# EAGLE board LCD-OLINUXINO-7TS_Rev_D (EAGLE 4.16)
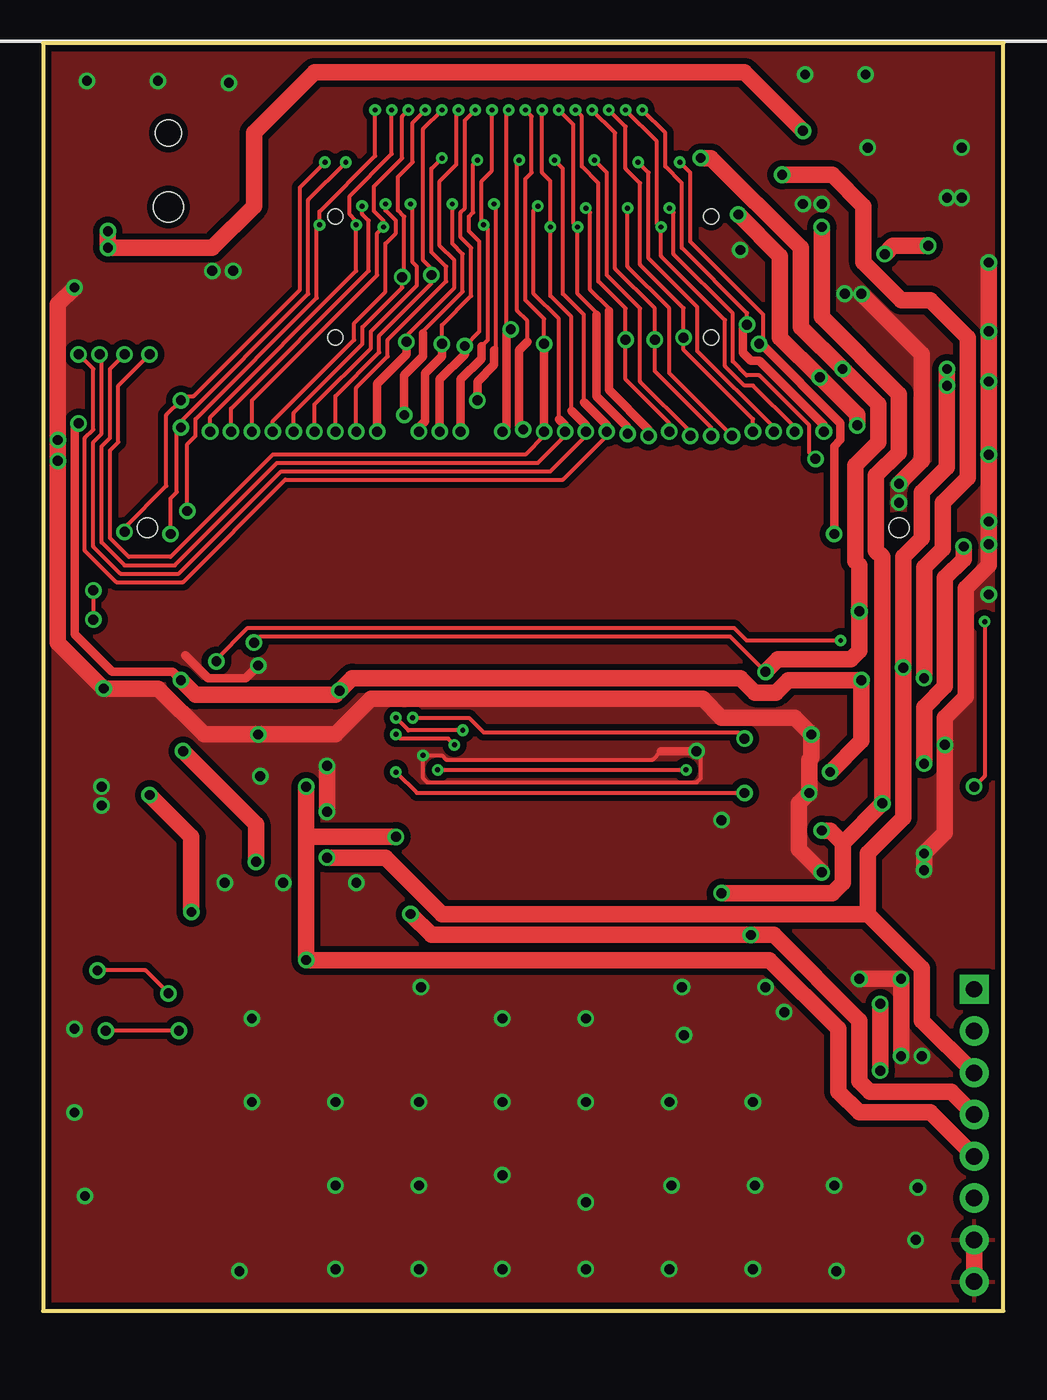
[diagram p1: board, top side]
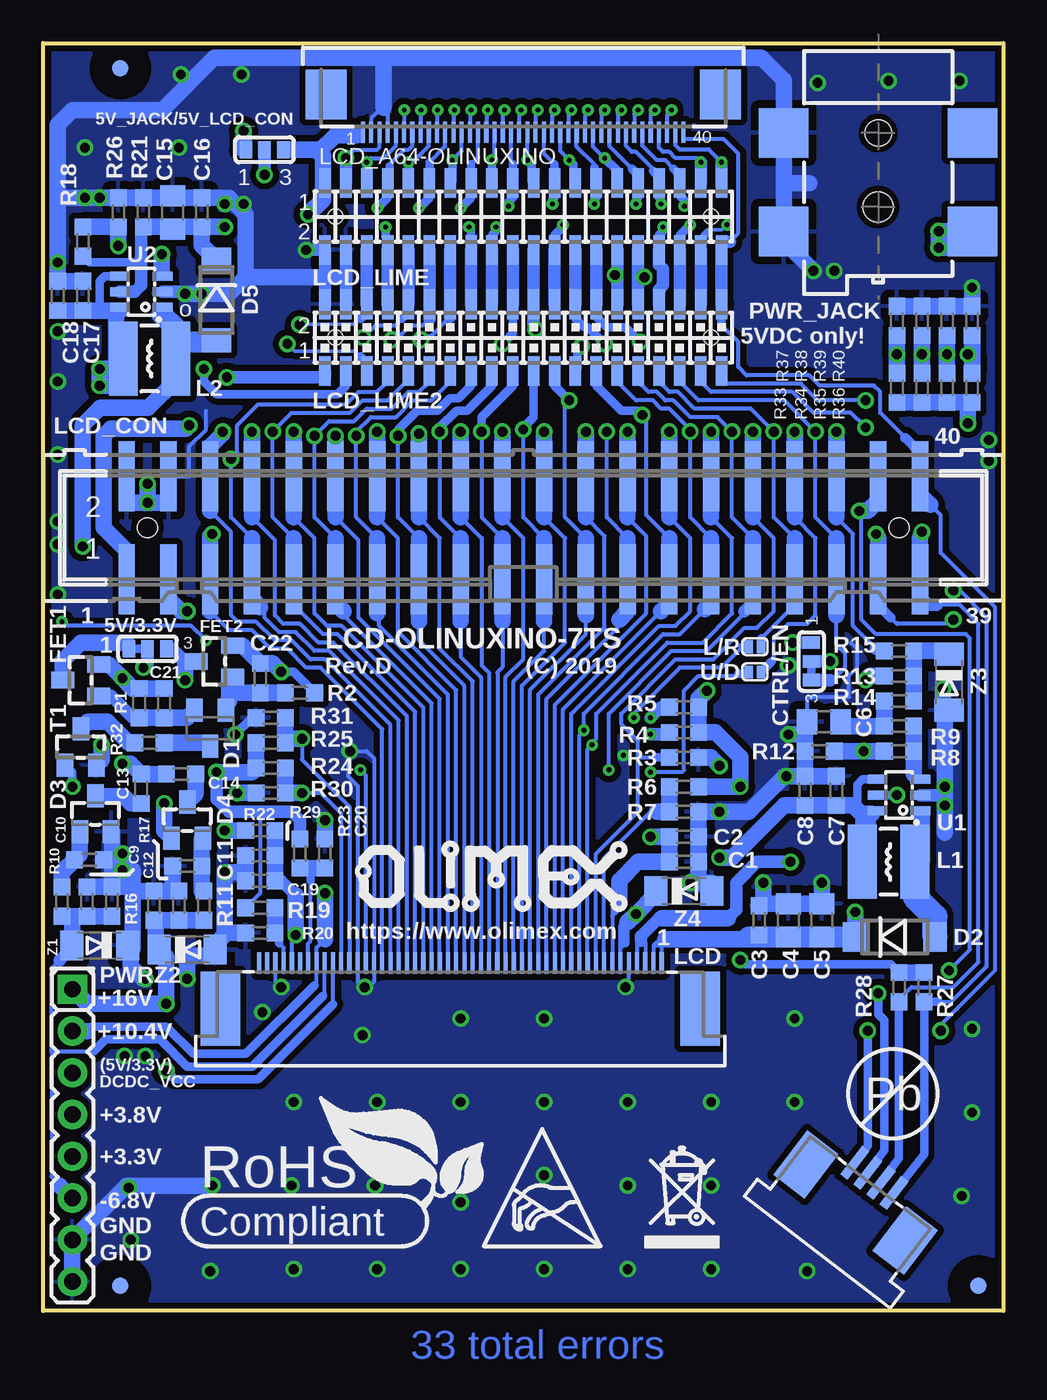
[diagram p2: board, bottom side, seen from below]

Size 58.42 x 77.09 mm. Coordinates in mm from the lower left corner, seen from the top.
Outline: 0,0 58.42,0 58.42,77.09 0,77.09 0,0
Copper layers (1+16): Top 0.035mm / dielectric 1.5mm / Bottom 0.035mm
Design rules "default": minimum track width 8mil, minimum drill 0.3mm, track to track 8mil, track to pad 8mil, pad to pad 8mil, via to via 8mil, smd to smd 1mil, copper to edge 10mil, drill to drill 8mil, minimum pad ring 8mil, minimum via ring 8mil, stop-mask expansion 4mil, vias tented up to drill 25mil, thermal gap 20mil
Net classes: 1 pwr: width 0.203 mm, drill 0.203 mm, clearance 0.203 mm

## Footprints (pad centres in the part's own frame; a part is rotated, then mirrored left to right if it is on the bottom)
SJ_2_SMALL_12_TIED = smd 0.762 x 1.016: 1 -1.143,0; 2 0,0; 3 1.143,0
SJ_2_SMALL = smd 0.762 x 1.016: 1 -1.143,0; 2 0,0; 3 1.143,0
C0603_DWS = smd 1.016 x 1.016: 1 -0.889,0; 2 0.889,0
C0805_5MIL_DWS = smd 1.27 x 1.524: 1 -1.016,0; 2 1.016,0
SJ_2_SMALL_23_TIED = smd 0.762 x 1.016: 1 -1.143,0; 2 0,0; 3 1.143,0
SOT23C = smd 1.4 x 1: 1 1.1,-0.95; 2 1.1,0.95; 3 -1.1,0
MLL-41 = smd 1.45 x 1.8: A 2.445,0; K -2.445,0
SOT23C(BAT54S) = smd 1.4 x 1: 1 1.1,-0.95; 2 1.1,0.95; 3 -1.1,0
SOT23 = smd 1.4 x 1: 1 1.1,-0.95; 2 1.1,0.95; 3 -1.1,0
CD42(43) = smd 1.75 x 4.5: 1 -1.6,0; 2 1.6,0
SJ_1_SMALLER = smd 0.508 x 0.762: 1 -0.381,0; 2 0.381,0
LCD7"_TOUCH(AT070TN90) = smd 0.25 x 1.3 bottom: 1 69.05,40.45; 2 69.55,40.45; 3 70.05,40.45; 4 70.55,40.45; 5 71.05,40.45; 6 71.55,40.45; 7 72.05,40.45; 8 72.55,40.45; 9 73.05,40.45; 10 73.55,40.45; 11 74.05,40.45; 12 74.55,40.45; 13 75.05,40.45; 14 75.55,40.45; 15 76.05,40.45; 16 76.55,40.45; 17 77.05,40.45; 18 77.55,40.45; 19 78.05,40.45; 20 78.55,40.45; 21 79.05,40.45; 22 79.55,40.45; 23 80.05,40.45; 24 80.55,40.45; 25 81.05,40.45; 26 81.55,40.45; 27 82.05,40.45; 28 82.55,40.45; 29 83.05,40.45; 30 83.55,40.45; 31 84.05,40.45; 32 84.55,40.45; 33 85.05,40.45; 34 85.55,40.45; 35 86.05,40.45; 36 86.55,40.45; 37 87.05,40.45; 38 87.55,40.45; 39 88.05,40.45; 40 88.55,40.45; 41 89.05,40.45; 42 89.55,40.45; 43 90.05,40.45; 44 90.55,40.45; 45 91.05,40.45; 46 91.55,40.45; 47 92.05,40.45; 48 92.55,40.45; 49 93.05,40.45; 50 93.55,40.45 | smd 0.55 x 2.2 rotated 217.5 bottom: 51 54.913,26.473; 52 55.707,27.082; 53 56.5,27.691; 54 57.294,28.299 | smd 2.4 x 4.5 bottom: P1 95.9,37.675; P2 66.7,37.675 | smd 2.4 x 3.4 rotated 217.5 bottom: P3 60.275,28.192; P4 54.245,23.566
FPV-WZA21-40-LF = smd 0.25 x 1.3: 1 -9.75,-2.75; 2 -9.25,-2.75; 3 -8.75,-2.75; 4 -8.25,-2.75; 5 -7.75,-2.75; 6 -7.25,-2.75; 7 -6.75,-2.75; 8 -6.25,-2.75; 9 -5.75,-2.75; 10 -5.25,-2.75; 11 -4.75,-2.75; 12 -4.25,-2.75; 13 -3.75,-2.75; 14 -3.25,-2.75; 15 -2.75,-2.75; 16 -2.25,-2.75; 17 -1.75,-2.75; 18 -1.25,-2.75; 19 -0.75,-2.75; 20 -0.25,-2.75; 21 0.25,-2.75; 22 0.75,-2.75; 23 1.25,-2.75; 24 1.75,-2.75; 25 2.25,-2.75; 26 2.75,-2.75; 27 3.25,-2.75; 28 3.75,-2.75; 29 4.25,-2.75; 30 4.75,-2.75; 31 5.25,-2.75; 32 5.75,-2.75; 33 6.25,-2.75; 34 6.75,-2.75; 35 7.25,-2.75; 36 7.75,-2.75; 37 8.25,-2.75; 38 8.75,-2.75; 39 9.25,-2.75; 40 9.75,-2.75 | smd 2.5 x 3: P1 12,-0.45; P2 -12,-0.45
ML40-MALE(GBH-254-SMT-40)_TEST = smd 1 x 4.25: 1 -24.13,-3.125; 2 -24.13,3.125; 3 -21.59,-3.125; 4 -21.59,3.125; 5 -19.05,-3.125; 6 -19.05,3.125; 7 -16.51,-3.125; 8 -16.51,3.125; 9 -13.97,-3.125; 10 -13.97,3.125; 11 -11.43,-3.125; 12 -11.43,3.125; 13 -8.89,-3.125; 14 -8.89,3.125; 15 -6.35,-3.125; 16 -6.35,3.125; 17 -3.81,-3.125; 18 -3.81,3.125; 19 -1.27,-3.125; 20 -1.27,3.125; 21 1.27,-3.125; 22 1.27,3.125; 23 3.81,-3.125; 24 3.81,3.125; 25 6.35,-3.125; 26 6.35,3.125; 27 8.89,-3.125; 28 8.89,3.125; 29 11.43,-3.125; 30 11.43,3.125; 31 13.97,-3.125; 32 13.97,3.125; 33 16.51,-3.125; 34 16.51,3.125; 35 19.05,-3.125; 36 19.05,3.125; 37 21.59,-3.125; 38 21.59,3.125; 39 24.13,-3.125; 40 24.13,3.125 | hole 1.2: -22.86,0; 22.86,0
YA-V36P-2X20-LF_0.9DRILL = smd 0.7 x 1.8: 1 -12.065,2.032; 2 -12.065,-2.032; 3 -10.795,2.032; 4 -10.795,-2.032; 5 -9.525,2.032; 6 -9.525,-2.032; 7 -8.255,2.032; 8 -8.255,-2.032; 9 -6.985,2.032; 10 -6.985,-2.032; 11 -5.715,2.032; 12 -5.715,-2.032; 13 -4.445,2.032; 14 -4.445,-2.032; 15 -3.175,2.032; 16 -3.175,-2.032; 17 -1.905,2.032; 18 -1.905,-2.032; 19 -0.635,2.032; 20 -0.635,-2.032; 21 0.635,2.032; 22 0.635,-2.032; 23 1.905,2.032; 24 1.905,-2.032; 25 3.175,2.032; 26 3.175,-2.032; 27 4.445,2.032; 28 4.445,-2.032; 29 5.715,2.032; 30 5.715,-2.032; 31 6.985,2.032; 32 6.985,-2.032; 33 8.255,2.032; 34 8.255,-2.032; 35 9.525,2.032; 36 9.525,-2.032; 37 10.795,2.032; 38 10.795,-2.032; 39 12.065,2.032; 40 12.065,-2.032 | hole 0.9: -11.43,0; 11.43,0
GPH127SMT-02X20(PA-V16X-2X20-LF)_DRILL_0.9MM = smd 0.7 x 1.8: 1 -12.065,-2.032; 2 -12.065,2.032; 3 -10.795,-2.032; 4 -10.795,2.032; 5 -9.525,-2.032; 6 -9.525,2.032; 7 -8.255,-2.032; 8 -8.255,2.032; 9 -6.985,-2.032; 10 -6.985,2.032; 11 -5.715,-2.032; 12 -5.715,2.032; 13 -4.445,-2.032; 14 -4.445,2.032; 15 -3.175,-2.032; 16 -3.175,2.032; 17 -1.905,-2.032; 18 -1.905,2.032; 19 -0.635,-2.032; 20 -0.635,2.032; 21 0.635,-2.032; 22 0.635,2.032; 23 1.905,-2.032; 24 1.905,2.032; 25 3.175,-2.032; 26 3.175,2.032; 27 4.445,-2.032; 28 4.445,2.032; 29 5.715,-2.032; 30 5.715,2.032; 31 6.985,-2.032; 32 6.985,2.032; 33 8.255,-2.032; 34 8.255,2.032; 35 9.525,-2.032; 36 9.525,2.032; 37 10.795,-2.032; 38 10.795,2.032; 39 12.065,-2.032; 40 12.065,2.032 | hole 0.9: -11.43,0; 11.43,0
HN1X8 = drill 1 pad 1.778 square: 1 -8.89,0 | drill 1 pad 1.778 round: 2 -6.35,0; 3 -3.81,0; 4 -1.27,0; 5 1.27,0; 6 3.81,0; 7 6.35,0; 8 8.89,0
PWR-JACK-SMD = smd 3 x 3: 1 6,5.75; 2 0,-5.75; 3 6,-5.75; 4 0,5.75 | hole 1.6: 0,0 | hole 1.8: 4.5,0
R0603_5MIL_DWS = smd 1.016 x 1.016: 1 -0.889,0; 2 0.889,0
SOT-23 = smd 1.4 x 1: 1 1.1,-0.95; 2 1.1,0.95; 3 -1.1,0
SOT23-6 = smd 1.2 x 0.55: 1 1.3,-0.95; 2 1.3,0; 3 1.3,0.95; 4 -1.3,0.95; 5 -1.3,0; 6 -1.3,-0.95
FIDUCIAL-1X3 = smd 1 x 1: 1 0,0
MINI-MELF = smd 1.4 x 1.8: 1 -1.7,0; 2 1.7,0

## Placement (x,y rotation side)
5V/3.3V  5V:Close/3.3V:Open  [SJ_2_SMALL_12_TIED]  52.07,40.26 0 bottom
5V_JACK/5V_LCD_CON  5V_JACK:Open/5V_LCD_CON:Soldered  [SJ_2_SMALL]  44.96,70.61 0 bottom
C1  22uF/6.3V  [C0603_DWS]  19.43,27.3 0 bottom
C2  100nF/Y5V/50VDC/20%  [C0603_DWS]  19.43,28.83 0 bottom
C3  100nF/Y5V/50VDC/20%  [C0603_DWS]  14.86,23.75 90 bottom
C4  1uF/25V/20%  [C0805_5MIL_DWS]  13.08,23.75 90 bottom
C5  1uF/25V/20%  [C0805_5MIL_DWS]  11.05,23.75 90 bottom
C6  10uF/16V  [C0805_5MIL_DWS]  10.92,35.81 180 bottom
C7  22uF/6.3V  [C0603_DWS]  10.16,31.62 270 bottom
C8  22uF/6.3V  [C0603_DWS]  12.06,31.62 270 bottom
C9  100nF/Y5V/50VDC/20%  [C0603_DWS]  55.75,24.89 90 bottom
C10  100nF/Y5V/50VDC/20%  [C0603_DWS]  55.63,27.43 0 bottom
C11  100nF/Y5V/50VDC/20%  [C0603_DWS]  49.66,27.05 180 bottom
C12  100nF/Y5V/50VDC/20%  [C0603_DWS]  51.69,24.64 90 bottom
C13  100nF/Y5V/50VDC/20%  [C0603_DWS]  52.45,31.75 90 bottom
C14  100nF/Y5V/50VDC/20%  [C0603_DWS]  50.04,32.64 0 bottom
C15  10uF/16V  [C0805_5MIL_DWS]  50.55,66.8 90 bottom
C16  100nF/Y5V/50VDC/20%  [C0603_DWS]  48.77,66.8 90 bottom
C17  22uF/6.3V  [C0603_DWS]  56.01,61.72 270 bottom
C18  22uF/6.3V  [C0603_DWS]  57.53,61.72 270 bottom
C19  100nF/Y5V/50VDC/20%  [C0603_DWS]  45.21,26.16 180 bottom
C20  100nF/Y5V/50VDC/20%  [C0603_DWS]  41.27,27.81 90 bottom
C21  22uF/6.3V  [C0603_DWS]  51.05,36.96 270 bottom
C22  100nF/Y5V/50VDC/20%  [C0603_DWS]  45.21,38.48 270 bottom
CTRL/EN  CTRL:Close/EN:Open  [SJ_2_SMALL_23_TIED]  11.68,39.5 270 bottom
D1  BAT54C  [SOT23C]  48.26,35.43 90 bottom
D2  1N5819/SS14  [MLL-41]  6.6,22.73 0 bottom
D3  BAT54S  [SOT23C(BAT54S)]  55.24,30.23 270 bottom
D4  BAT54S  [SOT23C(BAT54S)]  49.66,29.84 270 bottom
D5  1N5819/SS14  [MLL-41]  47.88,61.47 270 bottom
FET1  IRLML6402  [SOT23]  56.13,38.35 0 bottom
FET2  IRLML6402  [SOT23]  48.01,39.5 0 bottom
L1  4.7uH/1.15A/DCR<0.1R/CD43  [CD42(43)]  6.99,27.3 0 bottom
L2  4.7uH/1.15A/DCR<0.1R/CD43  [CD42(43)]  51.94,57.91 0 bottom
L/R  Open  [SJ_1_SMALLER]  15.11,40.39 0 bottom
LCD  AT070TN90+(FPV-WZA21-50-LF)+(FPA-WZB-25-04-LF)  [LCD7"_TOUCH(AT070TN90)]  -48.26,-19.29 0 top
LCD_A64-OLINUXINO  FPV-WZA21-40-LF  [FPV-WZA21-40-LF]  29.21,74.42 0 bottom
LCD_CON  GBH254SMT-40 (B-V-40-LF)  [ML40-MALE(GBH-254-SMT-40)_TEST]  29.21,47.62 0 bottom
LCD_LIME  GPH127SMT-02x20  [YA-V36P-2X20-LF_0.9DRILL]  29.21,66.55 0 bottom
LCD_LIME2  GPH127SMT-02x20  [GPH127SMT-02X20(PA-V16X-2X20-LF)_DRILL_0.9MM]  29.21,59.18 0 bottom
PWR  NA(HN1X8)  [HN1X8]  56.64,10.67 270 bottom
PWR_JACK  DCJ-W54R-20-LF  [PWR-JACK-SMD]  7.62,71.63 270 bottom
R1  20k/1%  [R0603_5MIL_DWS]  52.58,36.96 90 bottom
R2  20k/1%  [R0603_5MIL_DWS]  42.8,37.59 0 bottom
R3  NA  [R0603_5MIL_DWS]  19.43,33.66 180 bottom
R4  NA  [R0603_5MIL_DWS]  19.43,35.18 180 bottom
R5  NA  [R0603_5MIL_DWS]  19.43,36.7 180 bottom
R6  NA  [R0603_5MIL_DWS]  19.43,31.88 180 bottom
R7  10k  [R0603_5MIL_DWS]  19.43,30.35 180 bottom
R8  2.2k  [R0603_5MIL_DWS]  6.35,34.04 180 bottom
R9  20k/1%  [R0603_5MIL_DWS]  6.35,35.56 180 bottom
R10  1k/1%  [R0603_5MIL_DWS]  57.28,24.89 90 bottom
R11  1k/1%  [R0603_5MIL_DWS]  48.64,24.64 90 bottom
R12  2.2R  [R0603_5MIL_DWS]  11.18,34.04 180 bottom
R13  4.7k  [R0603_5MIL_DWS]  6.35,38.61 180 bottom
R14  4.7k  [R0603_5MIL_DWS]  6.35,37.08 180 bottom
R15  220R  [R0603_5MIL_DWS]  6.35,40.13 0 bottom
R16  51k/1%  [R0603_5MIL_DWS]  54.23,24.89 270 bottom
R17  51k/1%  [R0603_5MIL_DWS]  50.16,24.64 270 bottom
R18  51k/1%  [R0603_5MIL_DWS]  56.01,65.02 270 bottom
R19  10k  [R0603_5MIL_DWS]  45.21,24.51 0 bottom
R20  NA  [R0603_5MIL_DWS]  45.21,22.99 0 bottom
R21  20k/1%  [R0603_5MIL_DWS]  52.32,66.8 270 bottom
R22  1k/1%  [R0603_5MIL_DWS]  45.21,29.21 0 bottom
R23  10k  [R0603_5MIL_DWS]  42.8,27.81 270 bottom
R24  NA  [R0603_5MIL_DWS]  44.58,33.02 0 bottom
R25  10k  [R0603_5MIL_DWS]  44.58,34.54 0 bottom
R26  1k/1%  [R0603_5MIL_DWS]  53.85,66.8 90 bottom
R27  NA  [R0603_5MIL_DWS]  4.83,19.68 270 bottom
R28  NA  [R0603_5MIL_DWS]  6.35,19.68 270 bottom
R29  560R/1%  [R0603_5MIL_DWS]  45.21,27.69 180 bottom
R30  10k  [R0603_5MIL_DWS]  44.58,31.5 180 bottom
R31  NA  [R0603_5MIL_DWS]  44.58,36.07 180 bottom
R32  1k/1%  [R0603_5MIL_DWS]  51.94,34.54 0 bottom
R33  NA  [R0603_5MIL_DWS]  6.48,56.13 270 bottom
R34  NA  [R0603_5MIL_DWS]  4.95,56.13 270 bottom
R35  51k/1%  [R0603_5MIL_DWS]  3.43,56.13 270 bottom
R36  51k/1%  [R0603_5MIL_DWS]  1.91,56.13 270 bottom
R37  51k/1%  [R0603_5MIL_DWS]  6.48,60.2 270 bottom
R38  51k/1%  [R0603_5MIL_DWS]  4.95,60.2 270 bottom
R39  NA  [R0603_5MIL_DWS]  3.43,60.2 270 bottom
R40  NA  [R0603_5MIL_DWS]  1.91,60.2 270 bottom
T1  DTC114YKA  [SOT-23]  56.13,34.29 270 bottom
U1  AP3031KTR-G1  [SOT23-6]  6.35,31.37 0 bottom
U2  AP3031KTR-G1  [SOT23-6]  52.45,61.98 0 bottom
U$1  FIDUCIAL  [FIDUCIAL-1X3]  1.52,1.52 270 bottom
U$2  FIDUCIAL  [FIDUCIAL-1X3]  53.72,1.52 270 bottom
U$3  FIDUCIAL  [FIDUCIAL-1X3]  53.72,75.56 270 bottom
U$8  [OLIMEX1_V]  21.72,24.14 0 bottom
U$9  [PB]  6.73,13.21 0 bottom
U$10  [ESD_SYMBOL]  31.62,3.94 0 bottom
U$11  [RECYCLE_BIN1/8]  21.84,3.81 0 bottom
U$12  [ROHS]  48.9,4.57 0 bottom
U/D  Open  [SJ_1_SMALLER]  15.11,38.86 0 bottom
Z1  BZV55C6V8  [MINI-MELF]  54.99,22.23 180 bottom
Z2  BZV55C16  [MINI-MELF]  49.66,21.97 0 bottom
Z3  NA(BZV55C3V6)  [MINI-MELF]  3.3,38.23 270 bottom
Z4  NA(BZV55C4V3)  [MINI-MELF]  19.43,25.53 0 bottom

## Tracks (layer width: path | path; a pad name or v marks a point on that pad's centre or on a via)
+5V  (via drill 0.6)
  Top 1.016: 50.16,24.13 24.26,24.13 20.83,27.56 v17.27,27.56 | 50.16,24.13 50.16,27.81 52.32,29.97 v52.32,39.12 52.32,45.85 53.47,46.99 53.47,49.78 54.99,51.31 v54.99,56.26 v54.99,57.28 | 50.16,24.13 53.47,20.83 53.47,17.65 PWR.3
  Bottom 0.508: 53.72,60.83 53.72,61.03 U2.6 | U2.4 54.68,62.93 54.99,62.61 54.99,60.83 | U1.4 8.57,32.32 8.89,32 8.89,30.99 9.14,30.73 | U1.6 7.75,30.42 7.75,30.23 8,30.23
  Bottom 0.762: 5V/3.3V.2 52.07,39.37 v52.32,39.12
  Bottom 1.016: C18.2 C17.2 54.99,60.83 53.98,60.83 | 53.98,60.83 53.72,60.83 | v17.27,27.56 16.51,27.56 13.34,30.73 C8.2 C7.2 9.14,30.73 8.64,30.23 8.38,30.23 | 8.38,30.23 8,30.23 | L1.1 8.38,27.3 | 8.38,29.72 8.38,30.23 | L2.1 53.54,57.28 53.85,57.28 | 53.98,57.28 53.85,57.28 | 53.98,57.28 v54.99,57.28 v54.99,56.26 53.85,56.26 53.85,57.28 | 53.98,57.28 53.98,60.83
  Bottom 1.27: 8.38,27.3 8.38,29.72
+12V  (via drill 0.6)
  Top 1.016: v47.37,65.91 47.37,60.45 52.07,55.75 52.07,52.2 50.67,50.8 50.67,46.23 51.05,45.85 v51.05,30.86 48.64,28.45 | v41.27,25.4 48.01,25.4 48.64,26.04 48.64,28.45 | v47.37,29.21 47.88,29.21 48.64,28.45
  Bottom 0.254: 41.92,19.8 41.79,19.93 LCD.43 41.79,22.09 41.27,22.61
  Bottom 0.508: 52.47,63.75 55.63,63.75 R18.2 | 41.92,19.8 46.1,15.62 49.28,15.62 50.93,17.27 55.5,17.27 55.75,17.02
  Bottom 0.762: U2.5 52.85,61.98 52.47,62.36 52.47,63.75 52.47,65.91 R21.2
  Bottom 1.016: 50.55,65.91 R21.2 | 50.55,65.91 C15.1 | C16.1 50.55,65.91 | C16.1 48.77,64.8 D5.K | D4.1 51.05,29.19 v51.05,30.86 | v47.37,29.21 R22.1 | 55.75,17.02 PWR.2 | 41.27,22.61 v41.27,25.4 | v47.37,65.91 C16.1
+15V  (via drill 0.6)
  Top 1.016: v50.93,14.61 v50.93,18.67
  Bottom 0.254: 40.79,18.65 LCD.41
  Bottom 0.508: v50.93,14.61 50.42,14.1 45.34,14.1 40.79,18.65
  Bottom 1.016: R11.1 R17.2 51.56,23.75 | PWR.1 55.75,18.67 v50.93,18.67 50.93,21.54 Z2.1 51.56,22.18 51.56,23.75 | 51.56,23.75 C12.1
-24V
  Bottom 0.254: 57.4,21.34 57.91,20.83 57.91,15.75 | 57.4,7.62 57.91,8.13 57.91,15.75 | 55.37,15.75 57.91,15.75 | 41.4,19.18 41.29,19.29 LCD.42
  Bottom 0.508: 55.37,15.75 54.61,16.51 51.31,16.51 49.66,14.86 45.72,14.86 41.4,19.18
  Bottom 0.762: Z1.2 56.69,22.05 57.4,21.34
  Bottom 1.016: 57.4,7.62 PWR.6 | 56.64,24 C9.1 R16.2 | 56.64,24 R10.1 | Z1.2 56.64,22.27 56.64,24
GND  (via drill 0.3, 0.6, 0.6 pad 1.02)
  Top 0.254: 37.59,34.04 37.08,33.53 24.51,33.53 24.26,33.78 v23.11,33.78 23.11,32.38 23.37,32.13 39.75,32.13 40.01,32.38 40.01,33.78 v39.75,34.04
  Top 0.508: v39.75,34.04 37.59,34.04 | 8.64,39.88 10.03,38.48 12.32,38.48 v13.08,39.24
  Top 1.016: v47.37,26.67 45.97,28.07 45.97,30.86 v46.61,31.5 46.61,33.53 46.74,33.66 v46.74,35.05 45.72,36.07 41.27,36.07 40.13,37.21 19.94,37.21 17.78,35.05 v13.08,35.05 9.78,35.05 6.99,37.85 v3.68,37.85 0.89,40.64 v0.89,51.69 v0.89,52.96 0.89,61.21 v1.91,62.23 | v17.27,30.35 v17.27,33.15 | v49.66,20.19 v52.2,20.19 v52.2,15.49 | PWR.7 PWR.8 | v57.53,63.75 v57.53,48.01 v57.53,46.61 57.53,45.34 56.13,43.94 56.13,37.34 54.86,36.07 v54.86,34.42 54.86,29.08 v53.59,27.81 v53.59,26.8 | v52.07,50.29 53.47,51.69 53.47,58.17 v49.78,61.85
  Bottom 0.254: LCD_A64-OLINUXINO.2 38.46,72.54 37.85,73.15 37.72,73.15 37.46,72.89 LCD_A64-OLINUXINO.4 | LCD.5 22.79,19.88 v22.99,19.68 | v43.94,19.68 44.29,20.03 LCD.48 | C6.2 11.94,37.34 9.4,37.34 9.4,38.61 8.89,39.12 8.89,40.26 9.27,40.64 | LCD_CON.4 49.53,50.75 49.53,52.58 48.51,53.59 48.51,54.74 | 39.88,32.51 39.29,31.92 LCD.38 39.29,19.99 38.99,19.68 v38.86,19.68 38.61,19.68 38.29,20 LCD.36 38.29,33.59 38.73,34.04 v39.75,34.04 39.88,33.91 39.88,32.51
  Bottom 0.508: 45.59,31.5 R30.2 | R31.2 45.72,36.07 v46.74,35.05
  Bottom 0.762: v49.78,61.85 49.91,61.98 U2.2 | 41.27,62.87 LCD_LIME2.2 | 41.27,62.87 LCD_LIME.2 v42.42,64.52 | 40.01,62.87 LCD_LIME2.4 | 40.01,62.87 LCD_LIME.4 | 41.27,62.87 40.01,62.87 | 3.56,31.37 U1.2
  Bottom 1.016: v49.78,61.85 v48.77,61.85 47.12,61.85 46.1,62.87 | C17.1 C18.1 v57.53,63.75 57.53,67.69 | 50.55,67.69 R21.1 R26.2 v54.99,67.69 57.53,67.69 | 50.55,67.69 C15.2 | 50.55,67.69 C16.2 47.12,67.69 46.1,66.67 46.1,62.87 | 50.55,25.53 C11.2 | 46.1,26.67 R29.2 | 46.1,26.67 v47.37,26.67 47.37,23.11 47.24,22.99 | 46.1,26.67 C19.2 | v46.61,31.5 45.59,31.5 | 14.61,24.77 C4.2 C5.2 v11.05,26.04 | 14.61,24.77 14.86,24.77 C3.2 14.73,24.77 14.61,24.77 | C8.1 C7.1 | C8.1 R12.2 12.06,35.05 | C6.2 12.06,35.69 12.06,35.05 | v13.08,35.05 12.06,35.05 | v17.27,33.15 17.78,33.66 R3.1 | 46.1,62.87 41.27,62.87 | LCD_CON.4 50.8,49.15 v52.07,49.15 | v52.07,49.15 53.34,49.15 LCD_CON.2 | v3.68,37.85 3.68,36.53 Z3.2 3.56,36.53 v3.56,31.88 3.56,31.37 v3.56,30.73 3.56,29.08 | T1.2 54.86,33.51 v54.86,34.42 | PWR.8 PWR.7 53.34,7.62 v48.13,7.62 | 57.53,67.69 57.53,72.14 56.64,73.03 51.18,73.03 48.01,76.2 37.72,76.2 | 37.72,76.2 37.72,73.15 | 37.72,76.2 14.73,76.2 13.37,74.84 PWR_JACK.2 13.37,68.58 | C8.1 v13.21,32.51 13.34,32.51 15.49,30.35 v17.27,30.35 R7.1 C2.2 C1.2 18.54,26.04 | 14.61,24.77 v14.61,26.04 | 47.24,22.99 R20.1 | D3.2 54.23,29.13 54.23,27.43 | 54.23,27.43 C10.2 | 53.59,27.43 v53.59,27.81 | 54.23,27.43 53.59,27.43 | R16.1 54.23,27.43 | R16.1 C9.2 | C20.2 v41.27,29.84 | 53.59,27.43 v53.59,26.8 52.96,26.8 52.96,25.53 | 50.55,25.53 R17.1 | 50.55,25.53 C12.2 52.96,25.53 | v52.2,20.19 52.32,20.19 53.09,20.95 53.09,22.02 | 53.09,22.02 Z1.1 | v49.66,20.19 49.66,21.21 49.28,21.59 47.96,21.59 Z2.2 47.96,22.27 47.24,22.99 | 53.09,22.02 52.96,22.02 52.96,25.53 | 52.96,25.53 53.21,25.78 R16.1 | 18.54,26.04 v19.05,26.04 | Z4.2 17.73,26.04 18.54,26.04
  Bottom 1.016: 13.37,68.58 PWR_JACK.3 13.37,65.06 v11.56,63.25 | 13.37,68.58 11.81,68.58 | v1.91,62.23 R40.1 R39.1 R38.1 R37.1 | v52.07,50.29 v52.07,49.15
  other vias: 17.78,2.54 17.78,7.62 17.78,12.7 12.7,12.7 12.7,17.78 22.86,12.7 22.86,7.62 22.86,2.54 27.94,2.54 33.02,2.54 38.1,2.54 43.18,2.54 43.31,7.62 43.18,12.7 53.47,15.49 38.1,12.7 33.02,12.7 27.94,12.7 27.94,8.26 27.94,17.78 33.02,17.78 38.99,16.76 2.54,6.99 1.91,12.06 1.91,17.14 57.53,43.56 55.88,70.74 55.88,67.69 57.53,52.07 57.53,56.52 45.09,18.16 48.26,2.41 53.21,7.49 53.09,4.32 38.23,7.62 33.02,6.6 11.94,2.41 11.3,74.68 6.99,74.8 2.67,74.8 46.35,75.18 50.04,75.18 50.16,70.74 10.29,63.25 57.53,59.56 47.37,67.31 46.23,67.31
  pour Top (isolate 0.381, rank 2): -5.08,77.98 -5.08,-2.54 63.5,-2.54 63.5,77.98
  pour Bottom (isolate 0.381, rank 3): -7.62,-5.08 66.04,-5.08 66.04,80.52 -7.62,80.52
LCD_B0  (via drill 0.3, 0.6)
  Top 0.254: v28.96,69.98 28.83,69.85 28.83,60.83 29.46,60.2 29.46,58.93
  Top 0.508: 29.46,58.93 28.96,58.42 28.96,53.85 v29.21,53.59
  Bottom 0.254: LCD.19 29.79,38.28 27.94,40.13 27.94,41.92 | 27.94,46.99 29.21,48.26 v29.21,53.59 | LCD_A64-OLINUXINO.21 v28.96,69.98
  Bottom 0.508: v28.96,69.98 28.7,69.72 28.7,68.71 LCD_LIME.21 | LCD_LIME2.21 28.57,54.36 29.21,53.72 v29.21,53.59
  Bottom 1.016: 27.94,41.92 LCD_CON.21 27.94,46.99
LCD_B1  (via drill 0.3, 0.6)
  Top 0.254: v28.45,59.69 28.19,59.94 28.19,72.9 v28.32,73.03
  Top 0.508: v28.45,59.69 28.19,59.44 28.19,53.72 v27.94,53.47
  Bottom 0.254: LCD.18 29.29,38.02 26.67,40.64 26.67,46.99 27.94,48.26 | LCD_A64-OLINUXINO.22 28.46,72.89 v28.32,73.03
  Bottom 0.762: LCD_LIME.22 LCD_LIME2.22 28.57,59.82 v28.45,59.69
  Bottom 1.016: 27.94,48.26 LCD_CON.22 v27.94,53.47
LCD_B2  (via drill 0.3, 0.6)
  Top 0.254: v27.43,67.31 27.56,67.18 27.56,58.55 27.43,58.42
  Top 0.508: 27.43,58.42 27.43,57.53 26.42,56.52 v26.42,55.37
  Bottom 0.254: LCD.17 28.79,37.76 25.4,41.15 25.4,42.31 | 25.4,46.99 26.67,48.26 26.67,55.63 | LCD_A64-OLINUXINO.23 27.96,70.38 27.3,69.72
  Bottom 0.508: v27.43,67.31 27.43,67.56 27.3,67.69 LCD_LIME.23 27.3,69.72 | LCD_LIME2.23 27.3,56.26 26.67,55.63 v26.42,55.37
  Bottom 1.016: 25.4,42.31 LCD_CON.23 25.4,46.99
LCD_B3  (via drill 0.3, 0.6)
  Top 0.254: 26.67,58.67 27.05,59.05 27.05,65.79 v26.8,66.04 26.67,66.17 26.67,68.71 27.3,69.34 v27.3,73.03
  Top 0.508: 26.67,58.67 26.67,57.91 25.4,56.64 v25.4,53.47
  Bottom 0.254: LCD.16 28.29,37.5 24.26,41.53 24.26,47.12 25.4,48.26 | LCD_A64-OLINUXINO.24 27.46,72.87 v27.3,73.03
  Bottom 0.508: v26.8,66.04 26.8,65.91 27.3,65.41 LCD_LIME.24
  Bottom 0.762: LCD_LIME.24 LCD_LIME2.24
  Bottom 1.016: 25.4,48.26 LCD_CON.24 v25.4,53.47
LCD_B4  (via drill 0.3, 0.6)
  Top 0.254: v26.42,69.98 26.16,69.72 26.16,66.8 25.91,66.55 25.91,65.66 26.54,65.02 26.54,59.56 v25.65,58.67
  Top 0.508: v25.65,58.67 25.65,58.17 24.13,56.64 v24.13,53.47
  Bottom 0.254: LCD.15 27.79,37.23 23.37,41.66 23.37,42.04 | 22.86,46.99 24.13,48.26 v24.13,53.47 | LCD_A64-OLINUXINO.25 26.96,70.52 v26.42,69.98
  Bottom 0.508: v26.42,69.98 26.16,69.72 26.16,68.71 LCD_LIME.25 | LCD_LIME2.25 25.91,57.28 25.91,58.42 v25.65,58.67
  Bottom 1.016: 23.37,42.04 22.86,42.55 LCD_CON.25 22.86,46.99
LCD_B5  (via drill 0.3, 0.6)
  Top 0.254: v24.26,58.8 24.26,59.94 26.04,61.72 26.04,64.64 25.4,65.28 25.4,66.8 25.65,67.06 25.65,72.39 v26.29,73.03
  Top 0.508: v24.26,58.8 24.26,58.04 23.24,57.02 23.24,54.1 22.86,53.72 v22.86,53.47
  Bottom 0.254: LCD.14 27.29,36.84 21.72,42.42 21.72,47.12 22.86,48.26 | LCD_A64-OLINUXINO.26 26.46,72.85 v26.29,73.03
  Bottom 0.508: LCD_LIME2.26 26.04,60.33 25.53,59.82 25.27,59.82 v24.26,58.8
  Bottom 0.762: LCD_LIME2.26 LCD_LIME.26
  Bottom 1.016: 22.86,48.26 LCD_CON.26 v22.86,53.47
LCD_B6  (via drill 0.3, 0.6)
  Top 0.254: v24.89,67.31 24.89,64.9 25.53,64.26 25.53,61.98 23.11,59.56 23.11,59.44
  Top 0.508: 23.11,59.44 23.11,58.04 21.97,56.9 v21.97,54.48
  Bottom 0.254: LCD.13 26.79,36.58 20.83,42.55 | 20.32,46.99 21.72,48.39 21.72,54.23 v21.97,54.48 | LCD_A64-OLINUXINO.27 25.96,70.79 24.89,69.72 24.89,69.55
  Bottom 0.508: v24.89,67.31 24.89,67.56 24.77,67.69 LCD_LIME.27 24.89,68.71 24.89,69.55 | LCD_LIME2.27 24.77,56.26 23.24,54.74 22.23,54.74 v21.97,54.48
  Bottom 1.016: 20.83,42.55 20.32,43.05 LCD_CON.27 20.32,46.99
LCD_B7  (via drill 0.3, 0.6)
  Top 0.254: v22.1,58.93 22.1,59.31 25.02,62.23 25.02,63.88 24.13,64.77 24.13,68.71 25.15,69.72 25.15,72.9 v25.27,73.03
  Top 0.508: v22.1,58.93 22.1,58.17 20.32,56.39 v20.32,53.47
  Bottom 0.254: LCD.12 26.29,36.32 20.95,41.66 19.94,41.66 19.05,42.55 19.05,46.99 20.32,48.26 | LCD_A64-OLINUXINO.28 25.46,72.84 v25.27,73.03
  Bottom 0.508: LCD_LIME2.28 24.77,60.45 24.13,59.82 22.99,59.82 v22.1,58.93
  Bottom 0.762: LCD_LIME2.28 LCD_LIME.28
  Bottom 1.016: 20.32,48.26 LCD_CON.28 v20.32,53.47
LCD_BKL  (via drill 0.3, 0.6)
  Top 0.254: v10.16,53.47 10.16,54.36 19.05,63.25 v19.05,66.04 19.05,66.27 18.64,66.67 18.64,67.79 21.21,70.36 v21.21,73.03
  Bottom 0.254: 7.75,40.26 9.14,41.66 9.14,47.24 10.16,48.26 | LCD_A64-OLINUXINO.36 21.46,72.77 v21.21,73.03
  Bottom 0.508: LCD_LIME.36 19.68,65.41 v19.05,66.04
  Bottom 0.762: R15.1 7.24,40.26 7.75,40.26 | LCD_LIME.36 LCD_LIME2.36
  Bottom 1.016: 10.16,48.26 LCD_CON.36 v10.16,53.47
LCD_CLK  (via drill 0.3, 0.6)
  Top 0.254: v16.51,53.47 16.51,55.12 19.94,58.55 19.94,59.56 22.73,62.36 22.73,63.5 22.48,63.75 22.48,67.18 v22.35,67.31 | v24,32.89 v39.12,32.89
  Bottom 0.254: 15.24,46.99 16.51,48.26 v16.51,53.47 17.4,54.36 19.05,54.36 20.07,55.37 20.57,55.37 21.08,55.88 21.59,55.88 22.23,56.52 LCD_LIME2.31 | LCD_A64-OLINUXINO.31 23.96,70.82 22.61,69.47 | LCD.37 38.79,32.57 v39.12,32.89 | 15.75,42.55 15.75,42.42 18.03,40.13 20.19,40.13 24,36.32 v24,32.89
  Bottom 0.508: v22.35,67.31 22.35,67.56 22.23,67.69 LCD_LIME.31 22.23,69.09 22.61,69.47
  Bottom 0.762: 15.75,42.55 15.24,43.05 LCD_CON.31
  Bottom 1.016: LCD_CON.31 15.24,46.99
LCD_DE  (via drill 0.3, 0.6)
  Top 0.254: v15.24,53.47 15.24,54.61 19.43,58.8 19.43,59.82 21.84,62.23 v21.84,62.87 21.97,62.99 21.97,66.55 21.59,66.93 21.59,68.96 22.48,69.85 22.48,72.26 v23.24,73.03
  Bottom 0.254: LCD.9 24.79,27.79 22.23,30.35 22.23,33.66 | 22.23,33.66 22.23,34.67 23.24,35.69 23.24,36.32 19.94,39.62 17.65,39.62 15.75,41.53 14.99,41.53 13.97,42.55 13.97,46.99 15.24,48.26 | 22.23,33.66 21.08,33.66 | LCD_A64-OLINUXINO.32 23.46,72.81 v23.24,73.03
  Bottom 0.508: 21.08,33.66 R3.2
  Bottom 0.762: 22.23,62.87 LCD_LIME2.32 | 22.23,62.87 LCD_LIME.32 | v21.84,62.87 22.23,62.87
  Bottom 1.016: 15.24,48.26 LCD_CON.32 v15.24,53.47
LCD_G0  (via drill 0.3, 0.6)
  Top 0.254: v33.53,69.98 34.29,69.22 34.29,62.99 36.32,60.96 36.32,56.52 39.37,53.47 v39.37,53.21
  Bottom 0.254: LCD.27 33.79,37.47 37.97,41.66 37.97,42.31 38.1,42.43 | LCD_LIME2.13 33.66,56.52 34.8,55.37 35.94,55.37 36.96,54.36 38.48,54.36 39.37,53.47 v39.37,53.21 39.37,48.26 38.1,46.99 | LCD_A64-OLINUXINO.13 32.96,70.55 v33.53,69.98
  Bottom 0.508: v33.53,69.98 33.53,68.71 LCD_LIME.13
  Bottom 1.016: 38.1,42.43 LCD_CON.13 38.1,46.99
LCD_G1  (via drill 0.3, 0.6)
  Top 0.254: v38.1,53.47 38.1,53.98 35.43,56.64 v35.43,59.05 35.43,60.96 33.78,62.61 33.78,68.58 32.77,69.6 32.77,72.64 v32.38,73.03
  Bottom 0.254: LCD.26 33.29,37.75 36.83,41.29 36.83,46.99 38.1,48.26 | 33.66,60.45 34.8,59.31 35.18,59.31 v35.43,59.05 | LCD_A64-OLINUXINO.14 32.46,72.95 v32.38,73.03
  Bottom 0.762: LCD_LIME.14 LCD_LIME2.14 33.66,60.45
  Bottom 1.016: 38.1,48.26 LCD_CON.14 v38.1,53.47
LCD_G2  (via drill 0.3, 0.6)
  Top 0.254: v33.02,67.06 33.27,66.8 33.27,62.1 34.42,60.96 34.42,60.83
  Top 0.508: 34.42,60.83 34.42,56.01 36.83,53.59 v36.83,53.21
  Bottom 0.254: LCD.25 32.79,38.01 35.56,40.78 35.56,41.92 | 35.56,46.99 36.83,48.26 v36.83,53.21 | LCD_A64-OLINUXINO.15 31.96,70.15 32.38,69.72
  Bottom 0.508: v33.02,67.06 32.38,67.69 LCD_LIME.15 32.38,69.72 | v36.83,53.21 36.83,53.59 35.69,54.74 34.42,54.74 33.66,55.5 33.15,55.5 32.38,56.26 LCD_LIME2.15
  Bottom 1.016: 35.56,41.92 LCD_CON.15 35.56,46.99
LCD_G3  (via drill 0.3, 0.6)
  Top 0.254: 33.66,60.58 33.66,60.71 32.51,61.85 v32.51,65.91 32.26,66.17 32.26,72.14 v31.37,73.03
  Top 0.508: 33.66,60.58 33.66,55.63 35.56,53.72 v35.56,53.34
  Bottom 0.254: LCD.24 32.29,38.27 34.29,40.27 34.29,46.99 35.56,48.26 | LCD_A64-OLINUXINO.16 31.46,72.93 v31.37,73.03
  Bottom 0.508: LCD_LIME.16 32.38,65.79 v32.51,65.91
  Bottom 0.762: LCD_LIME.16 LCD_LIME2.16
  Bottom 1.016: 35.56,48.26 LCD_CON.16 v35.56,53.34
LCD_G4  (via drill 0.3, 0.6)
  Top 0.254: v31.11,69.98 31.62,69.47 31.62,61.85 32.89,60.58 32.89,55.24 | v34.29,53.47 34.29,53.21 31.62,50.55 14.73,50.55 8.51,44.32 4.45,44.32 2.54,46.23 2.54,53.09 3.05,53.59 3.05,57.28 v2.16,58.17
  Top 0.508: 32.89,55.24 34.29,53.85 v34.29,53.47
  Bottom 0.254: LCD.23 31.79,38.54 33.02,39.77 33.02,41.92 | 33.02,46.99 34.29,48.26 v34.29,53.47 | LCD_A64-OLINUXINO.17 30.96,70.26 31.11,70.1 v31.11,69.98
  Bottom 0.508: v31.11,69.98 LCD_LIME.17 | LCD_LIME2.17 31.11,56.26 32.64,54.74 33.27,54.74 34.29,53.72 v34.29,53.47
  Bottom 1.016: 33.02,41.92 LCD_CON.17 33.02,46.99 | 1.91,58.17 R36.1 | v2.16,58.17 1.91,58.17 | 1.91,58.17 R40.2
LCD_G5  (via drill 0.3, 0.6)
  Top 0.254: 32.13,54.74 32.13,60.45 30.86,61.72 v30.86,65.91 30.86,68.71 30.35,69.22 v30.35,73.03 | v33.02,53.47 33.02,53.21 30.86,51.05 14.48,51.05 8.26,44.83 4.7,44.83 3.05,46.48 3.05,52.83 3.56,53.34 3.56,58.04 v3.43,58.17
  Top 0.508: v33.02,53.47 33.02,53.85 32.13,54.74
  Bottom 0.254: LCD.22 31.29,38.8 31.75,39.26 31.75,46.99 33.02,48.26 | LCD_A64-OLINUXINO.18 30.46,72.92 v30.35,73.03
  Bottom 0.508: v30.86,65.91 30.86,65.66 31.11,65.41 LCD_LIME.18
  Bottom 0.762: LCD_LIME.18 LCD_LIME2.18
  Bottom 1.016: 33.02,48.26 LCD_CON.18 v33.02,53.47 | R35.1 v3.43,58.17 R39.2
LCD_G6  (via drill 0.3, 0.6)
  Top 0.254: v30.1,67.18 29.84,66.93 29.84,61.85 31.37,60.33 31.37,54.23 | v31.75,53.47 31.75,53.21 30.1,51.56 14.22,51.56 8,45.34 4.95,45.34 3.56,46.74 3.56,52.58 4.06,53.09 4.06,57.28 v4.95,58.17
  Top 0.508: v31.75,53.47 31.75,53.85 31.37,54.23
  Bottom 0.254: LCD.21 30.79,38.82 30.48,39.13 30.48,41.92 | 30.48,46.99 31.75,48.26 v31.75,53.47 | LCD_A64-OLINUXINO.19 29.96,69.84 29.84,69.72
  Bottom 0.508: v30.1,67.18 30.1,67.44 29.84,67.69 LCD_LIME.19 29.84,69.72 | v31.75,53.47 31.75,54.36 29.84,56.26 LCD_LIME2.19
  Bottom 1.016: 30.48,41.92 LCD_CON.19 30.48,46.99 | R34.1 v4.95,58.17 R38.2
LCD_G7  (via drill 0.3, 0.6)
  Top 0.254: v30.48,58.8 30.48,60.33 29.34,61.47 29.34,68.83 29.72,69.22 29.72,72.64 v29.34,73.03 | v30.48,53.47 30.48,53.21 29.34,52.07 13.97,52.07 7.75,45.85 5.21,45.85 4.06,46.99 4.06,52.32 4.57,52.83 4.57,56.26 v6.48,58.17
  Top 0.508: v30.48,53.47 v30.48,58.8
  Bottom 0.254: LCD.20 30.29,38.56 29.21,39.64 29.21,46.99 30.48,48.26 | LCD_A64-OLINUXINO.20 29.46,72.9 v29.34,73.03
  Bottom 0.508: LCD_LIME2.20 29.84,59.44 v30.48,58.8
  Bottom 0.762: LCD_LIME2.20 LCD_LIME.20
  Bottom 1.016: 30.48,48.26 LCD_CON.20 v30.48,53.47 | R33.1 v6.48,58.17 R37.2
LCD_HSYNC  (via drill 0.3, 0.6)
  Top 0.254: v25.53,35.31 22.23,35.31 v21.46,36.07 | v24.26,70.1 23.62,69.47 23.62,64.39 24.51,63.5 24.51,62.61 20.95,59.05 20.95,58.04 19.05,56.13 v19.05,53.47
  Bottom 0.254: LCD.11 25.79,35.04 v25.53,35.31 25.53,36.32 20.7,41.15 19.68,41.15 18.16,42.67 | 17.78,46.99 19.05,48.26 v19.05,53.47 19.05,53.59 20.32,54.86 20.83,54.86 21.34,55.37 22.35,55.37 23.5,56.52 LCD_LIME2.29 | LCD_A64-OLINUXINO.29 24.96,70.81 v24.26,70.1
  Bottom 0.508: v24.26,70.1 23.5,69.34 LCD_LIME.29
  Bottom 0.762: v21.46,36.07 20.83,36.7 R5.2
  Bottom 1.016: 18.16,42.67 17.78,43.05 LCD_CON.29 17.78,46.99
LCD_L/R  (via drill 0.3, 0.6)
  Top 0.254: v42.67,34.8 42.29,35.18 26.8,35.18 25.91,36.07 v22.48,36.07
  Bottom 0.254: LCD.39 39.79,30.65 42.67,33.53 v42.67,34.8 | 15.88,40.39 17.14,39.12 19.68,39.12 22.48,36.32 v22.48,36.07
  Bottom 0.508: L/R.1 15.88,40.39
  Bottom 1.016: 43.69,34.8 R31.1 | 43.69,34.8 R25.2 | v42.67,34.8 43.69,34.8
LCD_PWRE  (via drill 0.3, 0.6)
  Top 0.254: v11.43,53.47 11.43,54.86 19.81,63.25 19.81,66.29 19.41,66.7 v19.41,67.18
  Bottom 0.254: 10.16,46.99 11.43,48.26 v11.43,53.47 13.34,55.37 18.54,55.37 19.68,56.52 LCD_LIME2.35 | 10.54,38.35 10.41,38.35 9.65,39.12 9.65,40.01 10.16,40.51 10.16,42.29 | LCD_A64-OLINUXINO.35 21.96,70.86 21.08,69.98 20.57,69.98 20.07,69.47
  Bottom 0.508: v19.41,67.18 19.41,67.54 19.68,67.82 LCD_LIME.35 19.68,69.09 20.07,69.47
  Bottom 0.762: 10.54,38.35 CTRL/EN.3
  Bottom 1.016: 10.16,46.99 LCD_CON.35 10.16,42.29
LCD_R0  (via drill 0.3, 0.6)
  Top 0.254: v38.73,69.85 39.37,69.22 39.37,65.02 43.81,60.58 43.81,59.05 v43.56,58.8
  Top 0.508: v43.56,58.8 43.69,58.8 48.51,53.98 48.51,52.96 48.13,52.58 v48.13,47.24
  Bottom 0.203: 39.12,58.04 39.45,58.37 43.13,58.37 v43.56,58.8
  Bottom 0.254: LCD.35 37.79,35.38 41.53,39.12 42.42,39.12 43.56,40.26 44.58,40.26 45.72,41.4 47.12,41.4 48.26,42.55 | LCD_LIME.5 38.73,67.94 | LCD_A64-OLINUXINO.5 36.96,70.86 37.72,70.1 38.48,70.1 v38.73,69.85
  Bottom 0.508: v38.73,69.85 LCD_LIME.5 | LCD_LIME2.5 38.73,57.66 39.12,58.04
  Bottom 1.016: 48.26,42.55 LCD_CON.5 48.26,47.12 v48.13,47.24
LCD_R1  (via drill 0.3, 0.6)
  Top 0.254: v42.82,59.97 42.82,60.68 38.86,64.64 38.86,68.58 37.85,69.6 37.85,71.63 v36.45,73.03
  Top 0.508: v42.82,59.97 42.57,59.72 42.57,58.27 43.05,57.78 43.56,57.78 47.5,53.85 v47.5,53.47
  Bottom 0.203: v42.82,59.97 42.8,59.99 39.45,59.99 39.12,60.33
  Bottom 0.254: 48.26,48.64 46.99,47.37 46.99,42.31 46.59,41.91 45.47,41.91 44.32,40.77 43.29,40.77 42.15,39.62 41.27,39.62 37.29,35.64 LCD.34 | LCD_A64-OLINUXINO.6 36.46,73.01 v36.45,73.03
  Bottom 0.508: LCD_LIME2.6 38.73,60.71 39.12,60.33
  Bottom 0.762: LCD_LIME2.6 LCD_LIME.6
  Bottom 1.016: 48.26,48.64 LCD_CON.6 48.26,52.58 47.5,53.34 v47.5,53.47
LCD_R2  (via drill 0.3, 0.6)
  Top 0.254: v38.1,67.06 38.35,66.8 38.35,64.26 41.96,60.66 41.96,57.73 42.8,56.9 43.56,56.9 46.61,53.85 46.61,52.2 v46.99,51.82
  Bottom 0.254: LCD.33 36.79,35.9 41.02,40.13 41.91,40.13 43.05,41.27 44.07,41.27 44.96,42.16 44.96,42.55 45.21,42.8 | LCD_LIME2.7 37.47,56.52 38.1,55.88 39.24,55.88 40.01,55.12 45.34,55.12 46.61,53.85 46.61,52.2 v46.99,51.82 46.99,48.26 45.72,46.99 | 37.34,69.6 37.34,69.72 36.45,70.61 36.2,70.61 35.96,70.85 LCD_A64-OLINUXINO.7
  Bottom 0.508: v38.1,67.06 37.47,67.69 LCD_LIME.7 37.34,68.71 37.34,69.6
  Bottom 1.016: 45.21,42.8 45.72,43.31 LCD_CON.7 45.72,46.99
LCD_R3  (via drill 0.3, 0.6)
  Top 0.254: v45.72,53.47 45.72,53.72 43.18,56.26 42.67,56.26 41.48,57.45 41.48,60.25 37.59,64.14 v37.59,65.91 37.34,66.17 37.34,71.12 v35.43,73.03
  Bottom 0.254: LCD.32 36.29,36.16 40.77,40.64 41.66,40.64 42.8,41.78 43.81,41.78 44.32,42.29 44.32,46.86 45.72,48.26 | LCD_A64-OLINUXINO.8 35.46,73 v35.43,73.03
  Bottom 0.508: v37.59,65.91 37.59,65.28 37.47,65.15 LCD_LIME.8
  Bottom 0.762: LCD_LIME.8 LCD_LIME2.8
  Bottom 1.016: 45.72,48.26 LCD_CON.8 v45.72,53.47
LCD_R4  (via drill 0.3, 0.6)
  Top 0.254: v36.2,69.85 36.83,69.22 36.83,64.01 39.8,61.04 39.8,58.37 44.45,53.72 v44.45,53.47
  Bottom 0.254: LCD.31 35.79,36.42 40.51,41.15 41.4,41.15 43.18,42.93 | LCD_LIME.9 v36.2,69.85 36.07,69.98 35.81,69.98 34.96,70.83 LCD_A64-OLINUXINO.9 | LCD_LIME2.9 36.2,56.64 37.47,55.37 38.99,55.37 39.75,54.61 43.31,54.61 v44.45,53.47 44.45,48.26 43.18,46.99
  Bottom 0.508: v36.2,69.85 LCD_LIME.9
  Bottom 1.016: 43.18,42.93 LCD_CON.9 43.18,46.99
LCD_R5  (via drill 0.3, 0.6)
  Top 0.254: v43.18,53.47 43.18,54.23 38.96,58.45 v38.96,59.18 38.96,60.98 36.32,63.63 36.32,68.58 35.43,69.47 35.43,72.01 v34.42,73.03
  Bottom 0.254: LCD.30 35.29,36.69 40.26,41.66 41.15,41.66 41.91,42.42 41.91,46.99 43.18,48.26 | 36.58,60.33 36.96,59.94 38.2,59.94 v38.96,59.18 | LCD_A64-OLINUXINO.10 34.46,72.98 v34.42,73.03
  Bottom 0.508: LCD_LIME2.10 36.2,60.71 36.58,60.33
  Bottom 0.762: LCD_LIME2.10 LCD_LIME.10
  Bottom 1.016: 43.18,48.26 LCD_CON.10 v43.18,53.47
LCD_R6  (via drill 0.3, 0.6)
  Top 0.254: v35.56,67.06 35.56,63.5 38.1,60.96 38.1,57.02 v41.91,53.21
  Bottom 0.254: LCD.29 34.79,36.95 40.01,42.16 40.01,42.42 40.13,42.55 | LCD_LIME2.11 34.92,56.52 35.56,55.88 36.2,55.88 37.21,54.86 38.73,54.86 39.5,54.1 41.02,54.1 v41.91,53.21 41.91,48.26 40.64,46.99 | LCD_A64-OLINUXINO.11 33.96,70.81 34.92,69.85
  Bottom 0.508: v35.56,67.06 34.92,67.69 LCD_LIME.11 34.92,69.85
  Bottom 1.016: 40.13,42.55 40.64,43.05 LCD_CON.11 40.64,46.99
LCD_R7  (via drill 0.3, 0.6)
  Top 0.254: v40.64,53.21 40.64,53.72 37.21,57.15 v37.21,59.05 37.21,60.96 34.8,63.37 34.8,71.63 v33.4,73.03
  Bottom 0.254: LCD.28 34.29,37.21 39.24,42.16 39.24,46.86 40.64,48.26 | 34.92,60.33 35.31,59.94 36.07,59.94 36.96,59.05 v37.21,59.05 | LCD_A64-OLINUXINO.12 33.46,72.97 v33.4,73.03
  Bottom 0.762: LCD_LIME.12 LCD_LIME2.12 34.92,60.33
  Bottom 1.016: 40.64,48.26 LCD_CON.12 v40.64,53.21
LCD_U/D  (via drill 0.3, 0.6)
  Top 0.254: v21.46,32.77 22.73,31.5 v42.67,31.5
  Bottom 0.254: v42.67,31.5 41.53,31.5 40.29,30.26 LCD.40 | v21.46,32.77 19.56,32.77 19.43,32.89 19.43,37.72 18.54,38.61 16.26,38.61 16.13,38.73
  Bottom 0.508: 16.13,38.73 15.49,38.73 U/D.1
  Bottom 1.016: v42.67,31.5 R30.1 R24.2
LCD_VSYNC  (via drill 0.3, 0.6)
  Top 0.254: v25.02,34.42 24.64,34.8 21.72,34.8 v21.46,35.05 | v17.78,53.47 17.78,55.63 20.45,58.29 20.45,59.31 23.62,62.48 v23.62,62.99 23.62,63.37 23.11,63.88 23.11,71.88 v24.26,73.03
  Bottom 0.254: LCD.10 25.29,34.15 v25.02,34.42 25.02,34.54 24.77,34.8 24.77,36.32 20.45,40.64 18.29,40.64 16.51,42.42 16.51,46.99 17.78,48.26 | LCD_A64-OLINUXINO.30 24.46,72.82 v24.26,73.03
  Bottom 0.762: v21.46,35.05 20.45,35.05 R4.2 | 23.5,62.99 LCD_LIME2.30 | 23.5,62.99 LCD_LIME.30 | v23.62,62.99 23.5,62.99
  Bottom 1.016: 17.78,48.26 LCD_CON.30 v17.78,53.47
N$1
  Bottom 0.254: LCD.8 24.29,27.53 21.46,30.35 21.08,30.35
  Bottom 1.016: 21.08,30.35 R7.2 R6.2
N$2
  Bottom 1.016: D4.3 49.15,31.45 C14.2
N$3  (via drill 0.6)
  Top 0.254: v12.83,40.64 13.21,41.02 41.78,41.02 v43.94,38.86
  Top 1.016: v40.01,70.1 40.64,70.1 46.1,64.64 46.1,59.82 v48.64,57.28 50.8,55.12 50.8,52.83 49.4,51.44 49.4,45.59 49.66,45.34 v49.66,42.55 49.66,40.13 49.15,39.62 44.7,39.62 v43.94,38.86
  Bottom 0.254: LCD_A64-OLINUXINO.3 37.96,70.75 38.1,70.61 39.5,70.61 v40.01,70.1
  Bottom 0.508: LCD_LIME2.3 40.01,56.26 40.51,55.75 47.88,55.75 48.64,56.52 v48.64,57.28 | R2.2 43.18,38.86 v43.94,38.86
  Bottom 0.762: v40.01,70.1 LCD_LIME.3 | CTRL/EN.1 v12.83,40.64
  Bottom 1.016: LCD_CON.3 50.8,43.31 50.04,42.55 v49.66,42.55 | FET2.2 46.29,40.45 C22.1 44.45,39.37 v43.94,38.86
N$4
  Bottom 1.016: D4.2 48.77,28.68 C11.1 48.77,25.53 R11.2
N$5
  Bottom 0.508: U1.3 5.46,32.32 5.46,32.64
  Bottom 1.016: R9.1 R8.1 5.46,32.64
N$6
  Bottom 1.016: R10.2 57.28,26.67 C10.1 56.2,27.75 D3.1
N$7  (via drill 0.6)
  Top 1.016: v44.96,69.09 48.01,69.09 49.91,67.18 49.91,63.75 52.2,61.47 53.98,61.47 56.26,59.18 56.26,50.67 54.74,49.15 54.74,46.35 53.59,45.21 v53.59,38.48
  Bottom 0.762: v44.96,69.09 5V_JACK/5V_LCD_CON.2
  Bottom 1.016: C21.1 R1.2 52.96,37.85 v53.59,38.48 54.42,39.3 FET1.2
N$8
  Bottom 1.016: R2.1 C22.2 47.12,37.59 | D1.1 47.31,36.89 47.12,37.08 47.12,37.59 | FET2.1 47.12,38.34 47.12,37.59
N$9
  Bottom 0.762: FET1.1 54.3,37.4 52.96,36.07 R1.1
  Bottom 1.016: R1.1 C21.2 49.67,36.07 D1.2
N$10
  Bottom 1.016: D3.3 55.24,31.3 53.53,31.3 53.09,30.86 C13.1
N$11
  Bottom 1.016: R32.1 53.21,34.54 54.48,35.81 55.71,35.81 T1.3
N$12
  Bottom 1.016: R14.2 R9.2 9.91,35.56 C6.1
N$13
  Bottom 0.508: 4.95,30.1 4.95,30.42 U1.1
  Bottom 1.016: 4.95,30.1 4.95,27.3 L1.2
  Bottom 1.524: L1.2 5.38,25.2 4.16,23.97 D2.A
N$14
  Bottom 1.016: Z3.1 3.3,40.13 R15.2 R13.1 R14.1
N$15  (via drill 0.3, 0.6)
  Top 0.254: v20.83,67.31 20.83,66.93 21.46,66.29 21.46,65.53 20.83,64.9 20.83,61.98 18.92,60.07 18.92,59.05 13.97,54.1 v13.97,53.47
  Bottom 0.254: 12.7,46.99 13.97,48.26 v13.97,53.47 15.37,54.86 18.8,54.86 19.81,55.88 20.32,55.88 20.95,56.52 LCD_LIME2.33 | LCD_CON.33 12.7,42.93 14.73,40.89 | LCD_A64-OLINUXINO.33 22.96,70.84 22.61,70.48 22.35,70.48 21.34,69.47 21.34,69.34
  Bottom 0.508: v20.83,67.31 20.83,67.56 20.95,67.69 LCD_LIME.33 20.95,68.96 21.34,69.34 | L/R.2 14.73,40.89
  Bottom 1.016: LCD_CON.33 12.7,46.99
N$16  (via drill 0.3, 0.6)
  Top 0.254: v57.28,41.91 57.28,32.51 v56.64,31.88 | v48.51,40.77 42.8,40.77 42.04,41.53 12.45,41.53 10.54,39.62 v10.54,39.5
  Bottom 0.254: v57.28,41.91 57.15,41.91 56.9,41.66 49.4,41.66 v48.51,40.77
  Bottom 0.508: T1.1 56.64,32.75 v56.64,31.88
  Bottom 0.762: CTRL/EN.2 v10.54,39.5
N$17  (via drill 0.3, 0.6)
  Top 0.254: v12.7,53.47 12.7,55.37 20.32,62.99 20.32,65.53 v20.7,65.91 20.7,66.29 20.12,66.88 20.12,68.38 21.84,70.1 21.84,72.64 v22.23,73.03
  Bottom 0.254: 14.1,39.5 13.97,39.62 13.97,40.89 13.08,41.78 11.94,41.78 11.43,42.29 11.43,46.99 12.7,48.26 | LCD_A64-OLINUXINO.34 22.46,72.79 v22.23,73.03
  Bottom 0.508: LCD_LIME.34 20.95,65.41 20.7,65.66 v20.7,65.91 | U/D.2 14.1,39.5
  Bottom 0.762: LCD_LIME.34 20.95,63.63 20.7,63.37 20.7,62.36 20.95,62.1 LCD_LIME2.34
  Bottom 1.016: v12.7,53.47 LCD_CON.34 12.7,48.26
N$18
  Bottom 0.762: 5V/3.3V.1 53.21,40.51 53.34,40.64
  Bottom 1.016: FET1.3 57.23,39.54 56.13,40.64 53.34,40.64
N$19
  Bottom 1.016: D1.3 48.47,34.54 R32.2
N$22  (via drill 0.6)
  Top 1.016: v46.23,71.75 42.67,75.31 16.51,75.31 12.83,71.63 12.83,67.18 10.29,64.64 v3.94,64.64 v3.94,65.66
  Bottom 0.762: 46.23,70.61 5V_JACK/5V_LCD_CON.1
  Bottom 1.016: v46.23,71.75 46.23,70.61 | PWR_JACK.1 1.87,64.64 v3.94,64.64 v3.94,65.66 1.9,65.66 PWR_JACK.1
N$23  (via drill 0.6)
  Top 1.016: v49.53,53.85 49.53,54.48 v47.24,56.77 44.83,59.18 44.83,64.14 v42.29,66.67
  Bottom 0.254: 38.96,71.5 LCD_A64-OLINUXINO.1 | 39.34,71.5 38.96,71.5 | 38.96,71.5 38.96,71.88 39.37,71.88 | 38.96,71.5 38.96,71.12 39.37,71.12
  Bottom 0.762: LCD_LIME2.1 41.27,56.77 v47.24,56.77 | 41.4,68.58 LCD_LIME.1 | 43.69,70.61 5V_JACK/5V_LCD_CON.3
  Bottom 1.016: LCD_CON.1 53.34,46.23 54.74,47.62 54.74,53.21 54.3,53.65 49.73,53.65 v49.53,53.85 | v42.29,66.67 41.4,67.56 41.4,68.58 41.4,70.23 41.66,70.48 | 41.66,70.48 41.78,70.61 43.69,70.61 | 41.66,70.48 40.64,71.5 39.34,71.5
N$42
  Bottom 0.254: LCD.47 43.79,22.07 44.07,22.35
  Bottom 0.508: 44.07,22.35 44.07,22.99 R20.2
  Bottom 1.016: R20.2 R19.2
N$123  (via drill 0.6)
  Top 1.016: v53.59,33.27 53.59,36.7 54.86,37.97 54.86,44.58 56.01,45.72 v56.01,46.48
  Bottom 0.508: 51.18,60.58 51.18,61 U2.1
  Bottom 1.016: C14.1 C13.2 53.09,33.27 v53.59,33.27 | v56.01,46.48 56.01,53.85 54.94,54.91 52.02,54.91 50.34,56.59 L2.2
  Bottom 1.27: L2.2 50.34,58.33 | 50.34,58.33 50.34,59.74 51.18,60.58 | 50.34,58.33 50.34,58.93 47.88,58.93 D5.A
N$126  (via drill 0.6)
  Top 1.016: v51.2,64.26 51.7,64.77 v53.85,64.77
  Bottom 0.508: U2.3 51.2,62.93 51.2,63.25
  Bottom 1.016: 51.2,63.25 v51.2,64.26 | v53.85,64.77 R26.1 R18.1
RESET
  Bottom 0.254: LCD.44 42.29,22.35 42.16,22.48 42.16,26.16
  Bottom 0.508: 42.16,26.16 42.16,26.92
  Bottom 1.016: R23.2 42.16,26.92 C20.1
TPX1  (via drill 0.3, 0.6)
  Top 0.254: v18.41,69.85 16.13,67.56 16.13,61.85 8.38,54.1 v8.38,53.72 8.13,53.47 8.13,49.78 7.75,49.4 v7.75,47.24 | v3.05,43.81 v3.05,42.04
  Bottom 0.254: 3.94,18.8 3.17,18.8 1.02,20.95 1.02,42.16 2.67,43.81 v3.05,43.81 | LCD_LIME2.37 18.41,56.52 17.78,55.88 12.83,55.88 11.56,54.61 9.27,54.61 v8.38,53.72 | LCD_A64-OLINUXINO.37 20.96,70.74 20.7,70.48 20.32,70.48 19.94,70.1 18.67,70.1 v18.41,69.85 | 6.86,42.16 6.48,41.78 3.3,41.78 v3.05,42.04
  Bottom 0.508: LCD.51 4.83,9.53 R27.2 3.94,18.8
  Bottom 0.61: LCD_CON.37 7.62,42.93 6.86,42.16
  Bottom 0.762: v18.41,69.85 LCD_LIME.37
  Bottom 0.813: 7.62,46.99 7.75,47.12 v7.75,47.24
  Bottom 1.016: LCD_CON.37 7.62,46.99
TPX2  (via drill 0.3, 0.6)
  Top 0.254: v7.62,19.3 6.22,20.7 v3.3,20.7 | v8.76,48.64 8.76,52.7 9.27,53.21 9.27,54.23 16.64,61.59 16.64,65.86 v16.82,66.04 16.82,66.85 20.19,70.23 v20.19,73.03
  Bottom 0.203: 17.98,65.58 17.98,65.73 17.12,65.73 v16.82,66.04
  Bottom 0.254: v3.3,20.7 2.03,21.97 2.03,40.89 2.29,41.15 7.75,41.15 8.64,42.04 8.64,48.51 v8.76,48.64 | LCD_A64-OLINUXINO.38 20.46,72.76 v20.19,73.03
  Bottom 0.508: LCD.53 7.24,9.78 7.24,17.67 7.62,18.05 v7.62,19.3 | LCD_LIME.38 18.41,65.15 17.98,65.58
  Bottom 0.762: LCD_LIME.38 LCD_LIME2.38
  Bottom 1.016: LCD_CON.38 7.62,49.28 8.26,48.64 v8.76,48.64
TPY1  (via drill 0.3, 0.6)
  Top 0.254: v17.14,69.85 15.62,68.33 15.62,62.1 9.14,55.63 8.64,55.63 v8.38,55.37 7.49,54.48 7.49,50.16 4.95,47.62 v4.95,47.37
  Bottom 0.254: R28.2 6.35,18.92 5.59,19.68 3.05,19.68 1.52,21.21 1.52,41.78 2.67,42.93 4.06,42.93 | LCD_LIME2.39 17.14,56.39 12.32,56.39 11.3,55.37 v8.38,55.37 | LCD_A64-OLINUXINO.39 19.96,70.89 19.68,70.61 17.91,70.61 v17.14,69.85
  Bottom 0.508: LCD.52 6.35,9.27 R28.2
  Bottom 0.762: 4.06,42.93 4.57,42.93 5.08,43.43 LCD_CON.39 | v17.14,69.85 LCD_LIME.39 17.14,68.45
  Bottom 0.813: 5.08,46.99 5.08,47.24 v4.95,47.37
  Bottom 1.016: LCD_CON.39 5.08,46.99
TPY2  (via drill 0.6)
  Top 0.254: v8.26,17.03 v3.81,17.03
  Bottom 0.254: 4.45,49.02 3.81,48.39 3.81,46.1 0.51,42.8 0.51,20.7 3.81,17.4 v3.81,17.03 | 17.14,59.94 16.13,58.93 16.13,57.4 15.62,56.9 11.81,56.9 11.18,56.26 7.87,56.26 7.49,55.88 7.49,54.61 5.97,53.09 | LCD_A64-OLINUXINO.40 19.46,71.25 17.02,71.25 16.13,70.36 16.13,65.53 16.64,65.02
  Bottom 0.508: LCD.54 8.26,10.03 v8.26,17.03 | 17.14,59.94 LCD_LIME2.40
  Bottom 0.61: LCD_CON.40 5.08,52.2 5.97,53.09
  Bottom 0.762: LCD_LIME2.40 LCD_LIME.40 17.14,65.02 16.64,65.02
  Bottom 1.016: 4.45,49.02 5.08,49.66 LCD_CON.40
VCC  (via drill 0.6, 0.6 pad 1.02)
  Top 0.508: v8.38,38.35 7.87,38.86 4.19,38.86 1.91,41.15 1.91,53.72 v2.16,53.98
  Top 1.016: v47.88,32.77 49.78,34.67 v49.78,38.35 45.34,38.35 44.58,37.59 43.31,37.59 42.42,38.48 18.8,38.48 v18.03,37.72 17.78,37.47 9.27,37.47 v8.38,38.35 | 16,28.83 v16,21.34 44.2,21.34 48.39,17.14 48.39,13.34 49.66,12.06 53.98,12.06 PWR.5 | 16,28.83 v16,31.88 | 16,28.83 v21.46,28.83
  Bottom 0.254: R19.1 45.21,25.4 45.21,30.35 | 23.37,25.02 23.62,25.02 23.79,24.85 23.79,24.02 | 23.79,24.02 LCD.7 | 23.79,24.02 23.5,24.31 23.5,24.64
  Bottom 0.508: R28.1 6.86,21.08 15.75,21.08 v16,21.34
  Bottom 0.762: 23.37,25.02 23.37,24.77 23.5,24.64 | 5V/3.3V.3 50.55,40.26 49.78,39.5 | v47.88,32.77 47.88,31.11 47.12,30.35 45.21,30.35 43.31,30.35 42.8,29.84 R23.1
  Bottom 1.016: R24.1 R25.1 R24.1 | v47.88,32.77 45.72,32.77 R24.1 | 23.37,25.02 23.37,26.16 22.23,27.3 C1.1 C2.1 v21.46,28.83 | v8.38,38.35 8.13,38.61 R13.2 | R6.1 v16,31.88 16,33.66 17.53,35.18 R4.1 R5.1 18.54,37.21 v18.03,37.72 | R27.1 R28.1 | FET2.3 49.78,39.5 v49.78,38.35 | 2.16,55.24 R35.2 R34.2 R33.2 | 2.16,55.24 R36.2 | v2.16,53.98 2.16,55.24
VCOM  (via drill 0.6)
  Top 1.016: PWR.4 55.24,13.34 50.29,13.34 49.66,13.97 49.66,17.65 44.45,22.86 v43.05,22.86 23.62,22.86 v22.35,24.13
  Bottom 0.254: 23.29,22.05 23.29,23.45 23.11,23.62 22.86,23.62 | LCD.6 23.29,22.05 | 23.29,22.05 22.99,22.35 | LCD.46 43.29,22.62 v43.05,22.86
  Bottom 0.508: 22.99,22.35 22.99,23.5 22.86,23.62
  Bottom 0.762: 43.05,25.27 43.94,26.16 C19.1
  Bottom 1.016: R22.2 R29.1 C19.1 | Z4.1 21.13,25.35 v22.35,24.13 22.86,23.62 | v43.05,22.86 43.05,25.27
VLED+  (via drill 0.6)
  Top 1.016: v9.02,24.26 9.02,28.83 v6.48,31.37
  Bottom 0.254: LCD.1 20.79,22.23 21.29,22.23 | 21.29,22.23 LCD.2 | 21.29,22.23 20.91,22.61 20.57,22.61
  Bottom 0.508: v6.48,31.37 U1.5
  Bottom 1.016: D2.K 9.02,22.77 v9.02,24.26 | 14.86,22.73 C3.1 | 15.49,22.73 15.49,22.61 20.57,22.61
  Bottom 1.27: D2.K C5.1 C4.1 14.86,22.73 15.49,22.73
VLED-  (via drill 0.6)
  Top 1.016: v8.51,34.04 12.95,29.59 v12.95,27.3
  Bottom 0.254: LCD.4 22.29,22.29 22.1,22.48 22.05,22.48 | 22.05,22.48 21.84,22.48 21.79,22.43 LCD.3 | 22.05,22.5 22.05,22.48
  Bottom 0.762: v12.95,27.3 14.99,27.3 16.26,26.04 16.26,24.38 16.76,23.88 | 20.78,23.88 20.95,23.88 22.05,22.78 22.05,22.5
  Bottom 1.016: R8.2 v8.51,34.04 R12.1 | 16.76,23.88 20.78,23.88

## Text on the board
Bottom: 33 total errors
tNames: Da se iztrie beliq pe4at na LCD-to v TopSilk!
bNames: 3 | 1 | o | 5VDC only! | 40 | 39 | 1 | 1 | LCD-OLINUXINO-7TS | 3 | 1 | (C) 2019 | Rev.D | 3 | https://www.olimex.com | 1 | +16V | +10.4V | (5V/3.3V) | DCDC_VCC | +3.8V | +3.3V | -6.8V | GND | GND